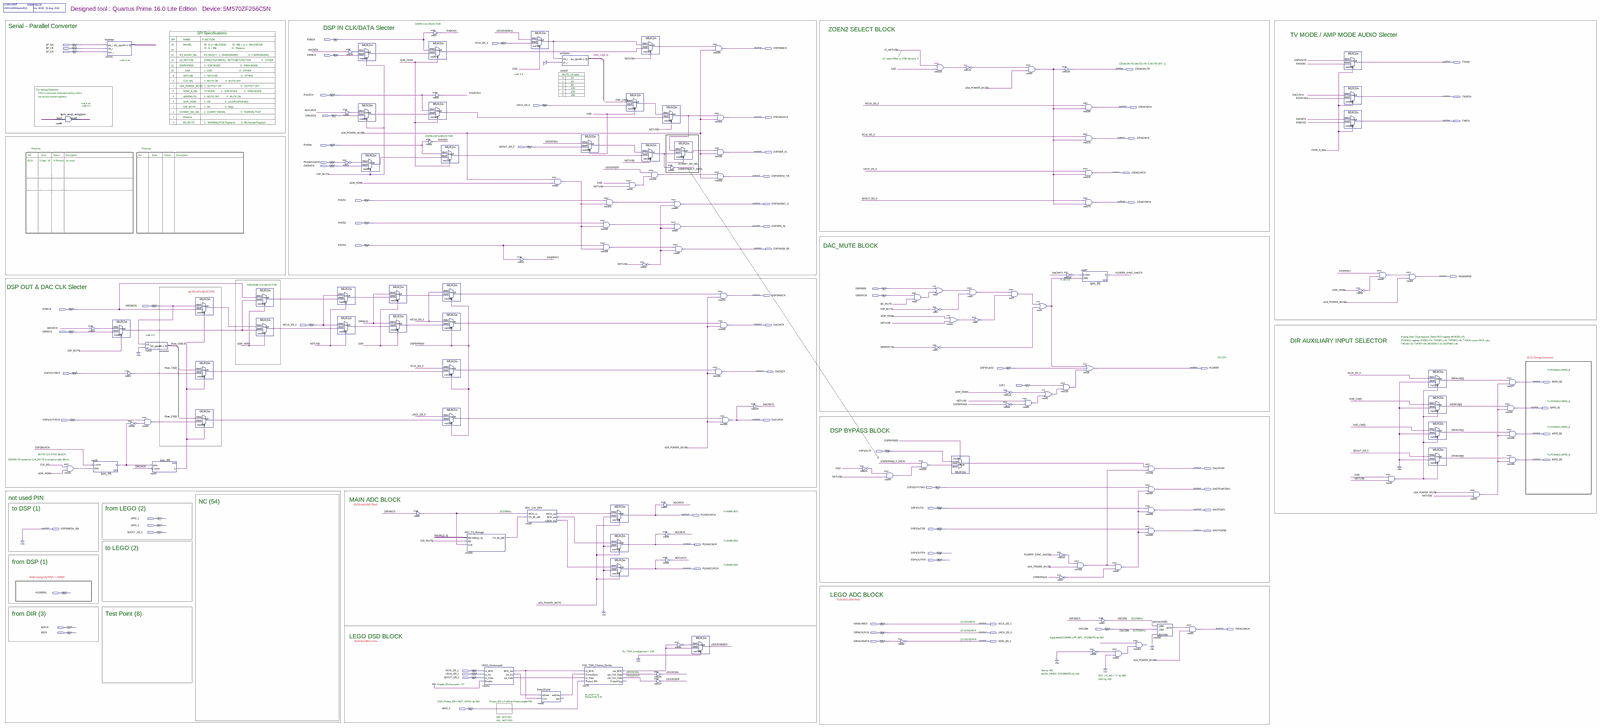
[diagram p0: schematic sheet, whole]
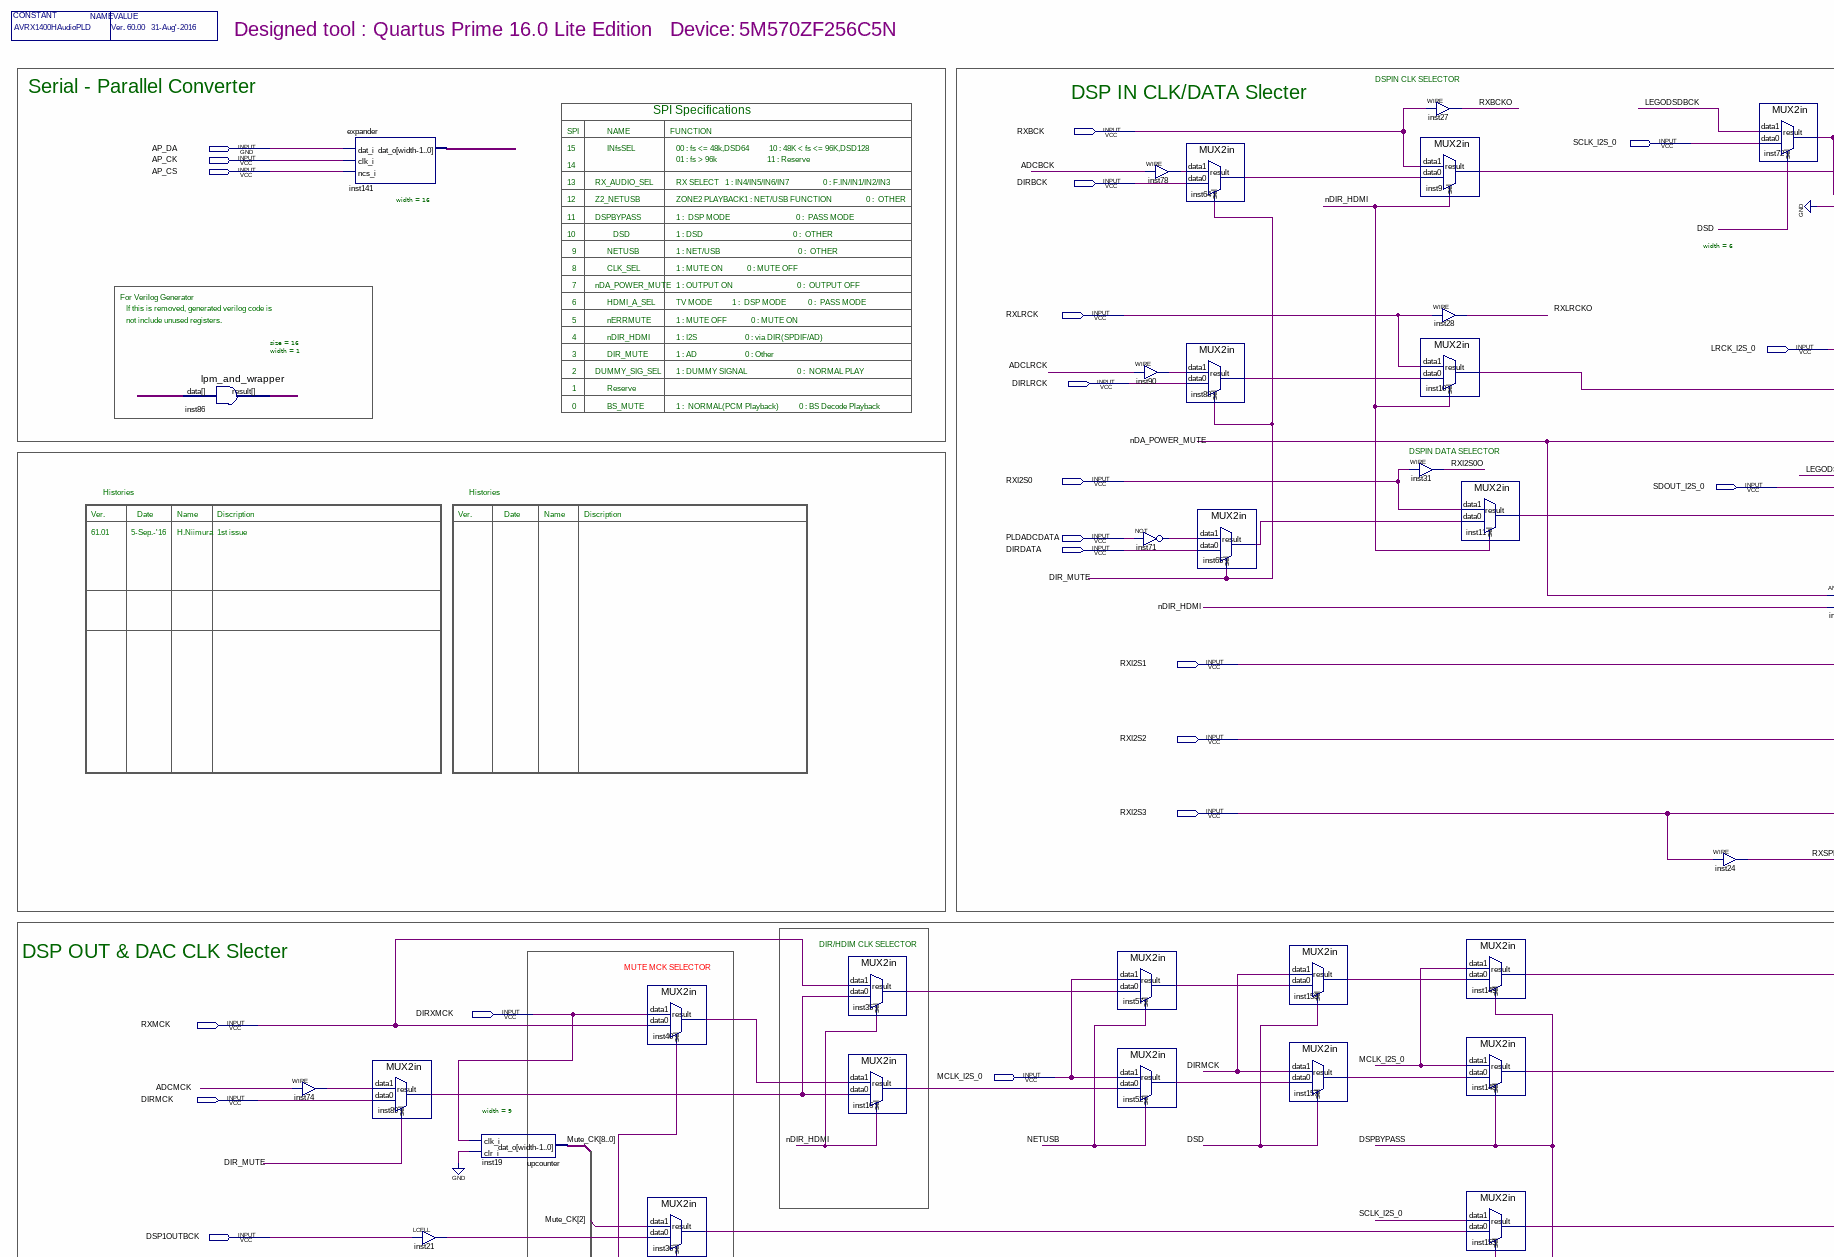
[diagram p1: schematic sheet, upper left part]
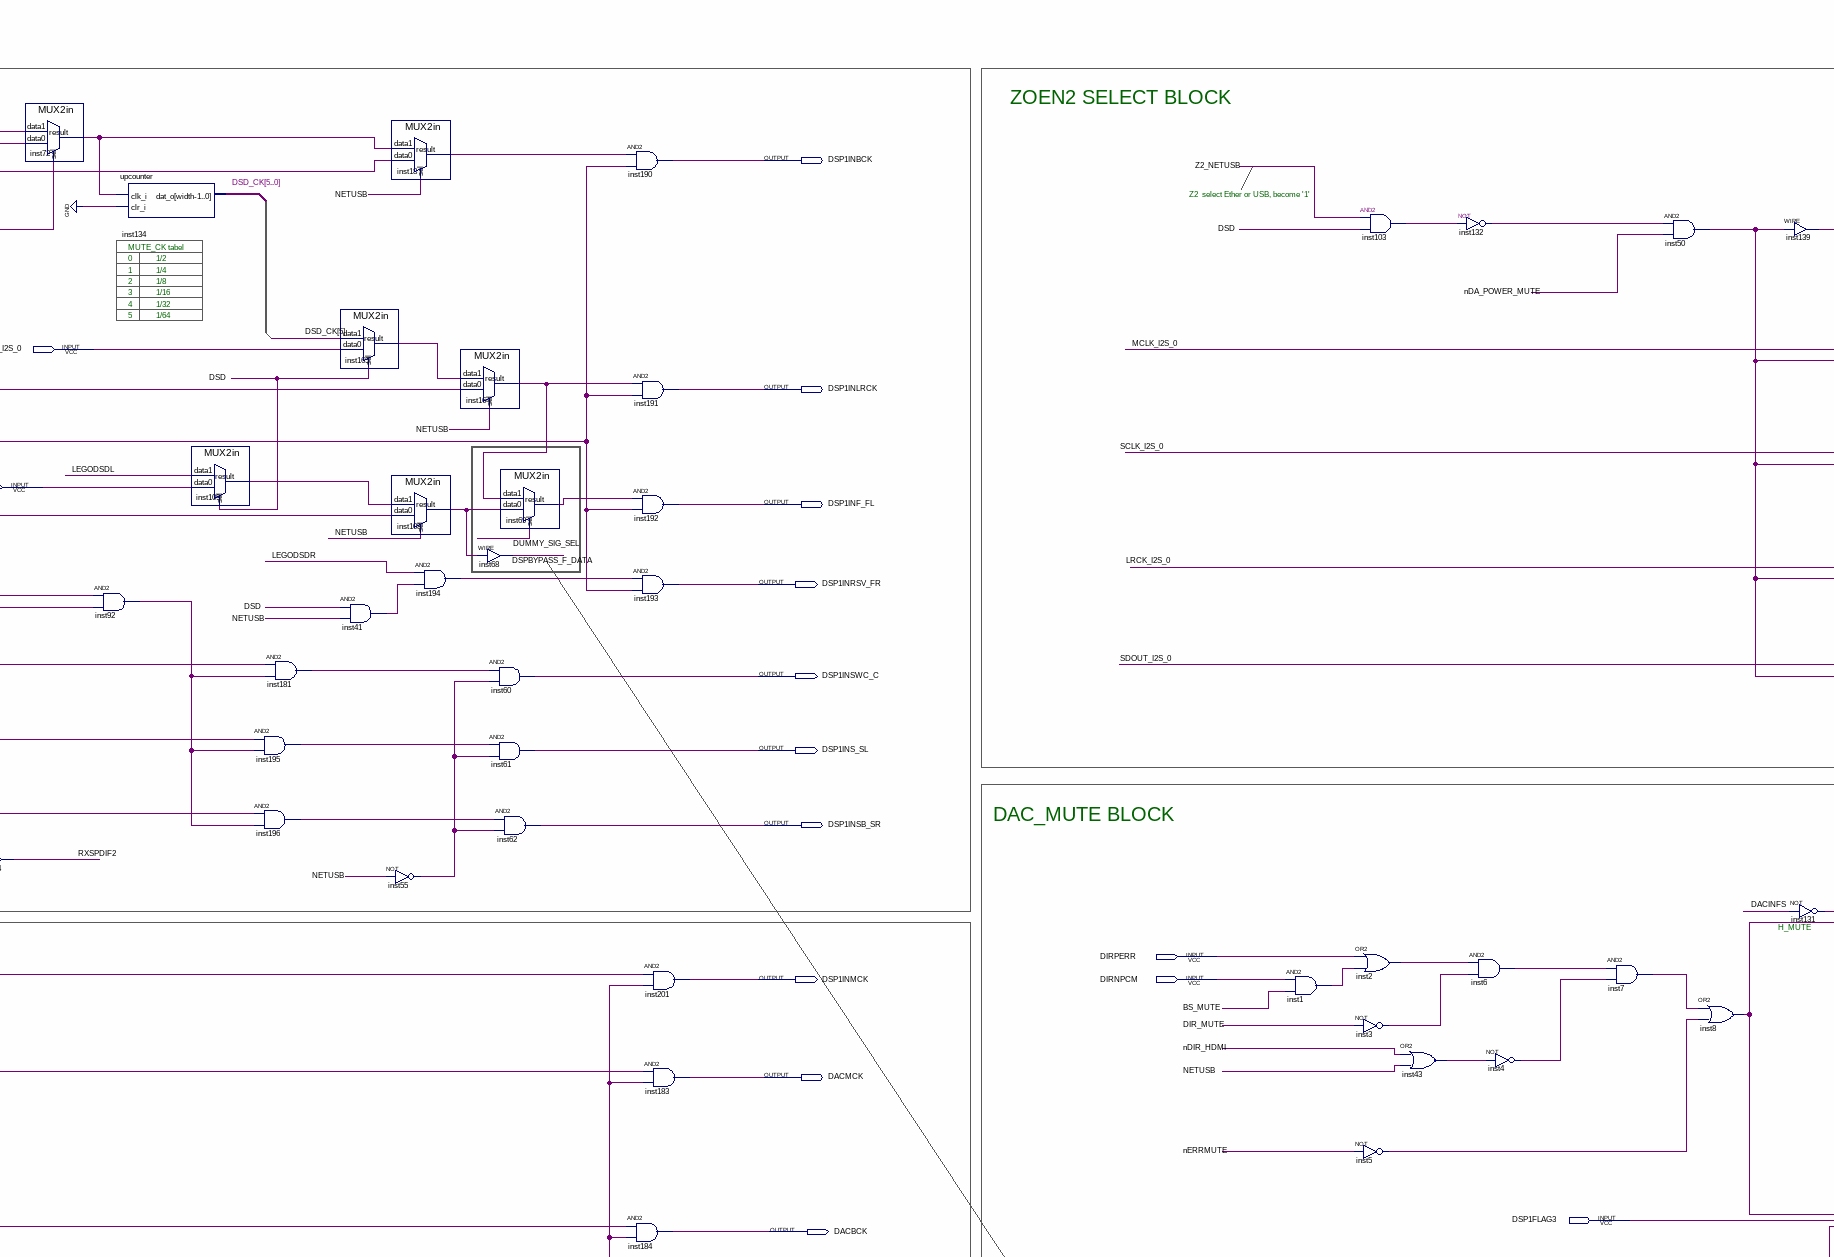
[diagram p2: schematic sheet, upper centre part]
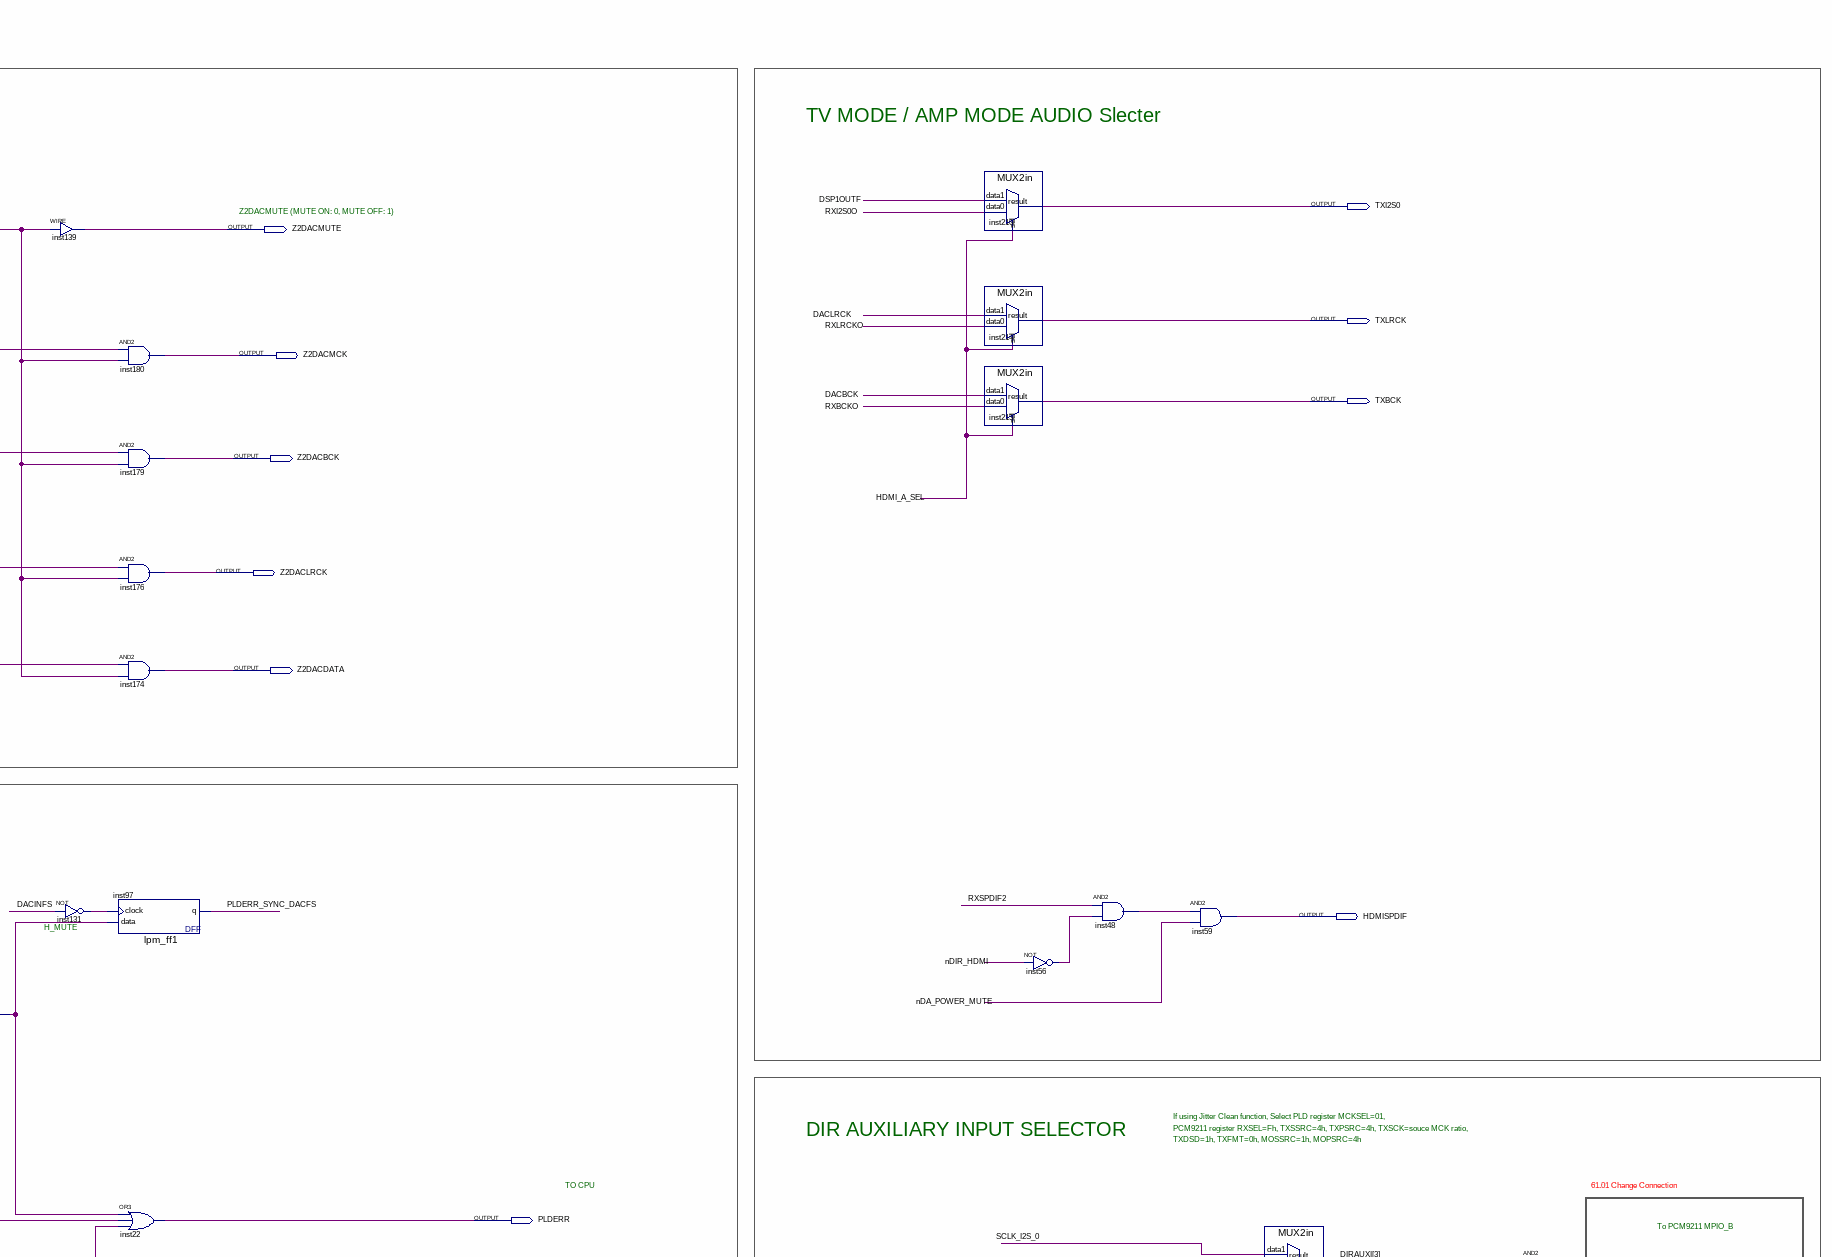
[diagram p3: schematic sheet, upper right part]
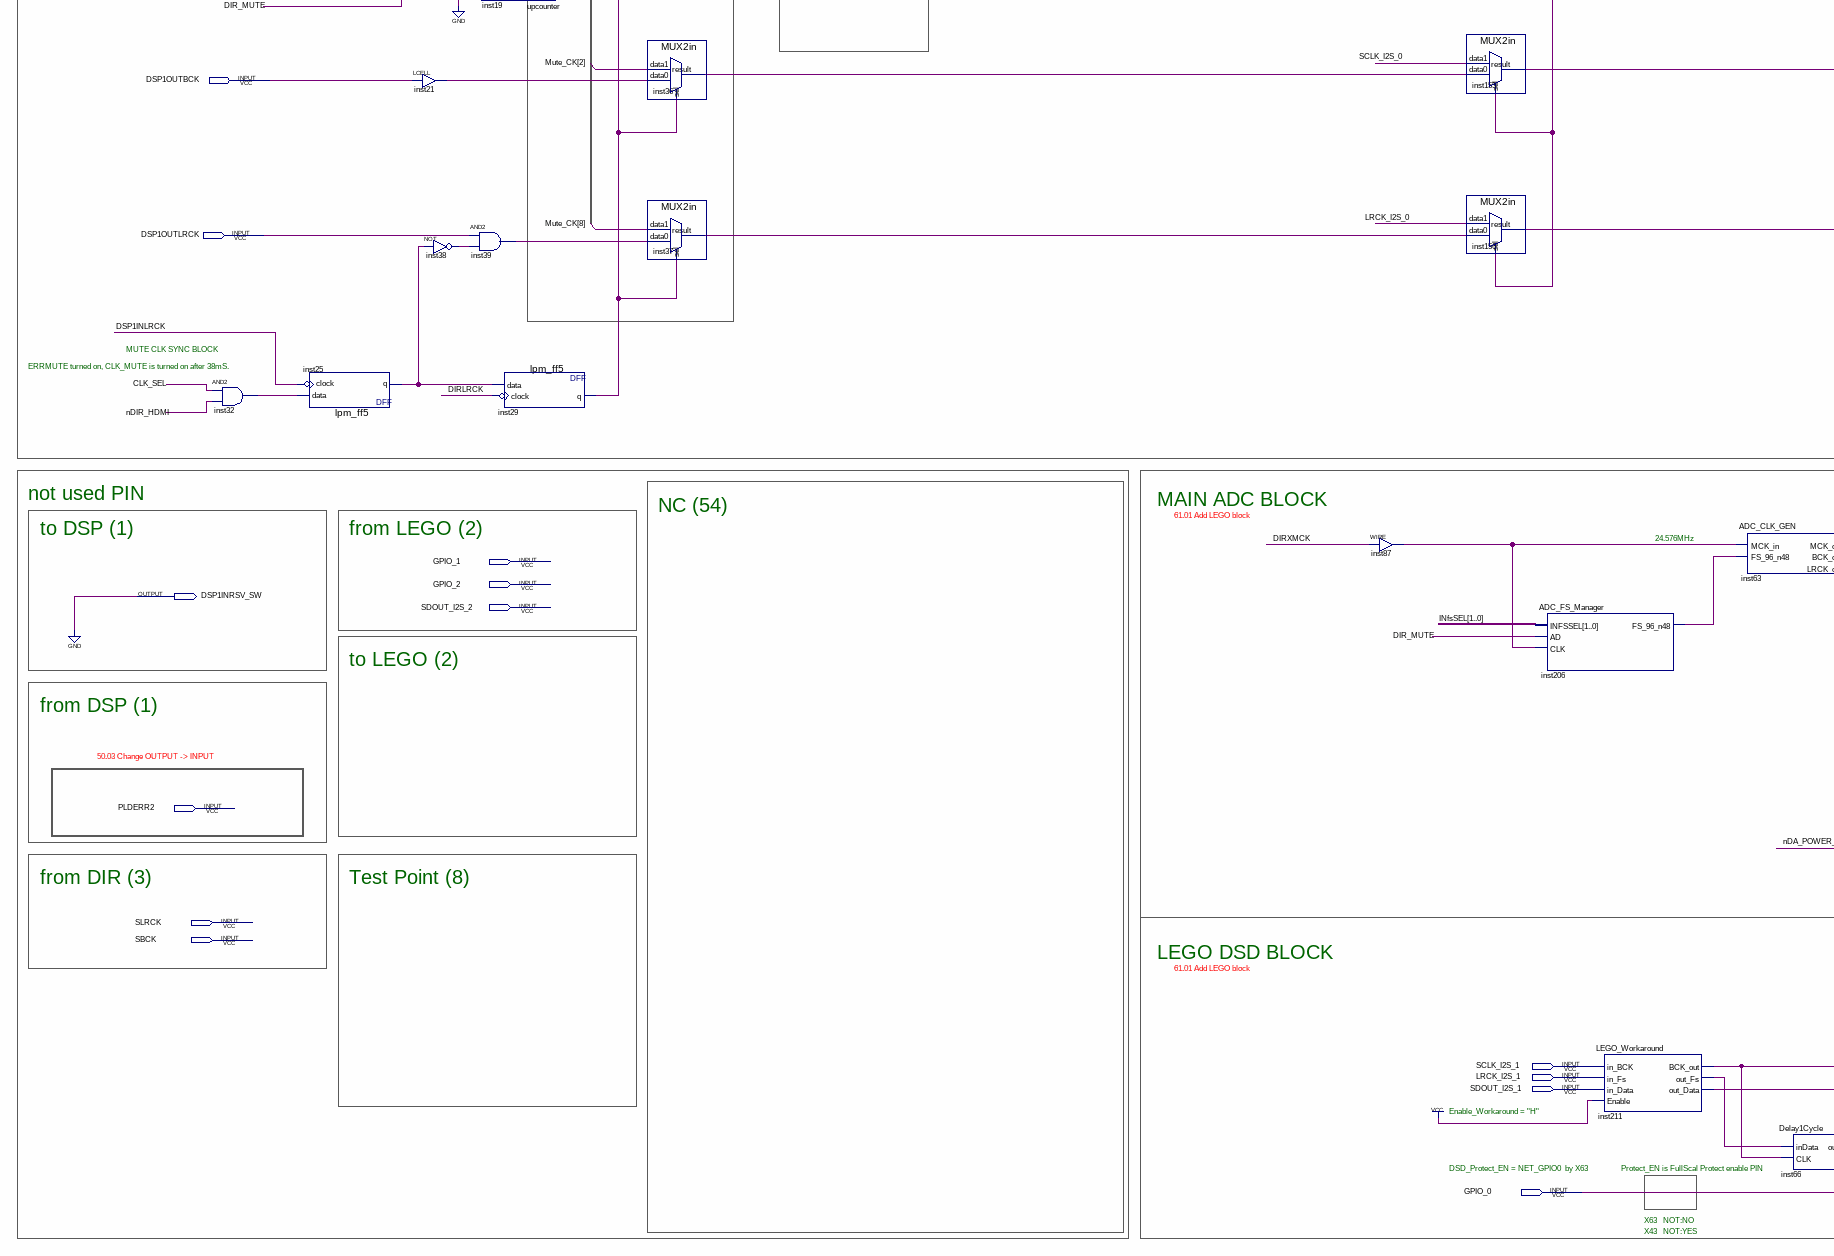
[diagram p4: schematic sheet, lower left part]
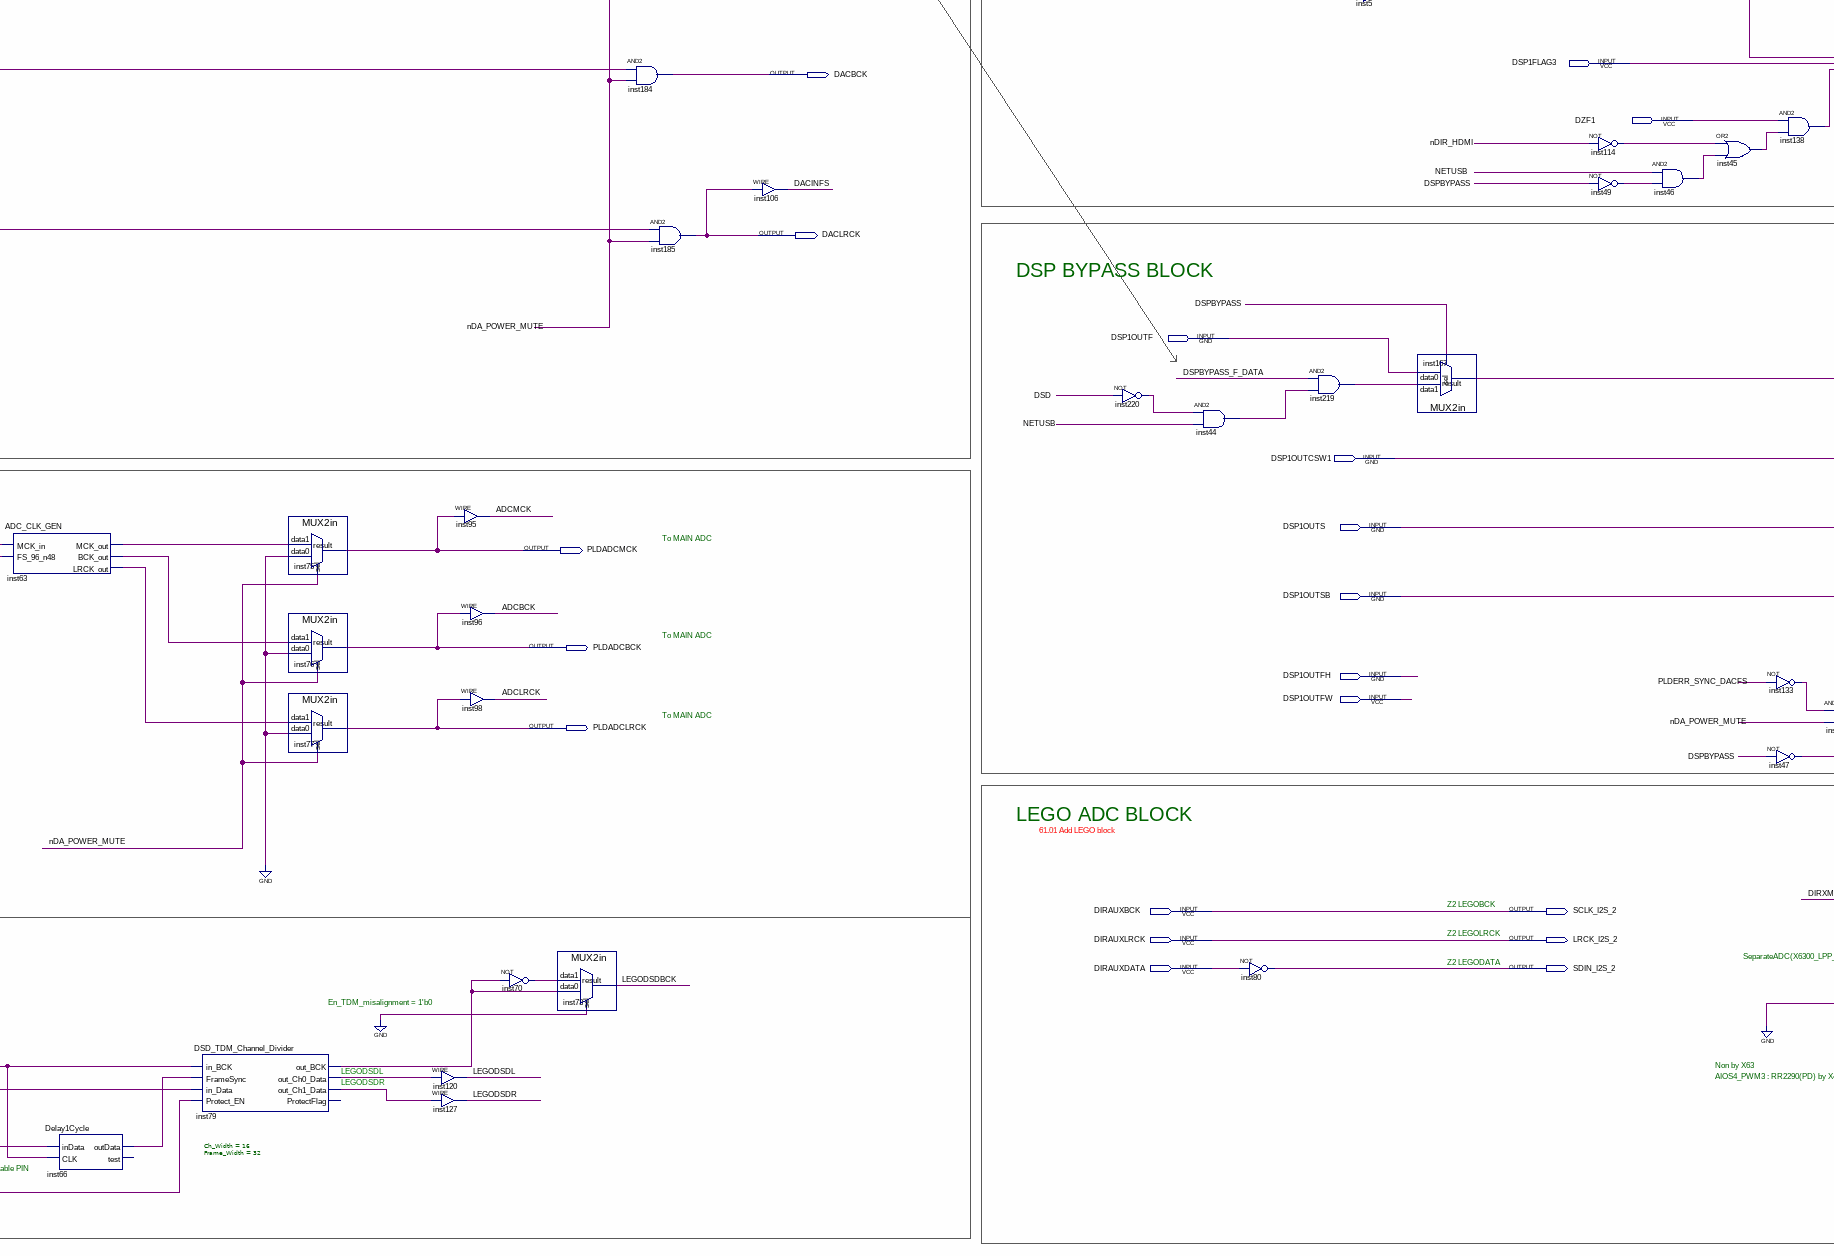
[diagram p5: schematic sheet, lower centre part]
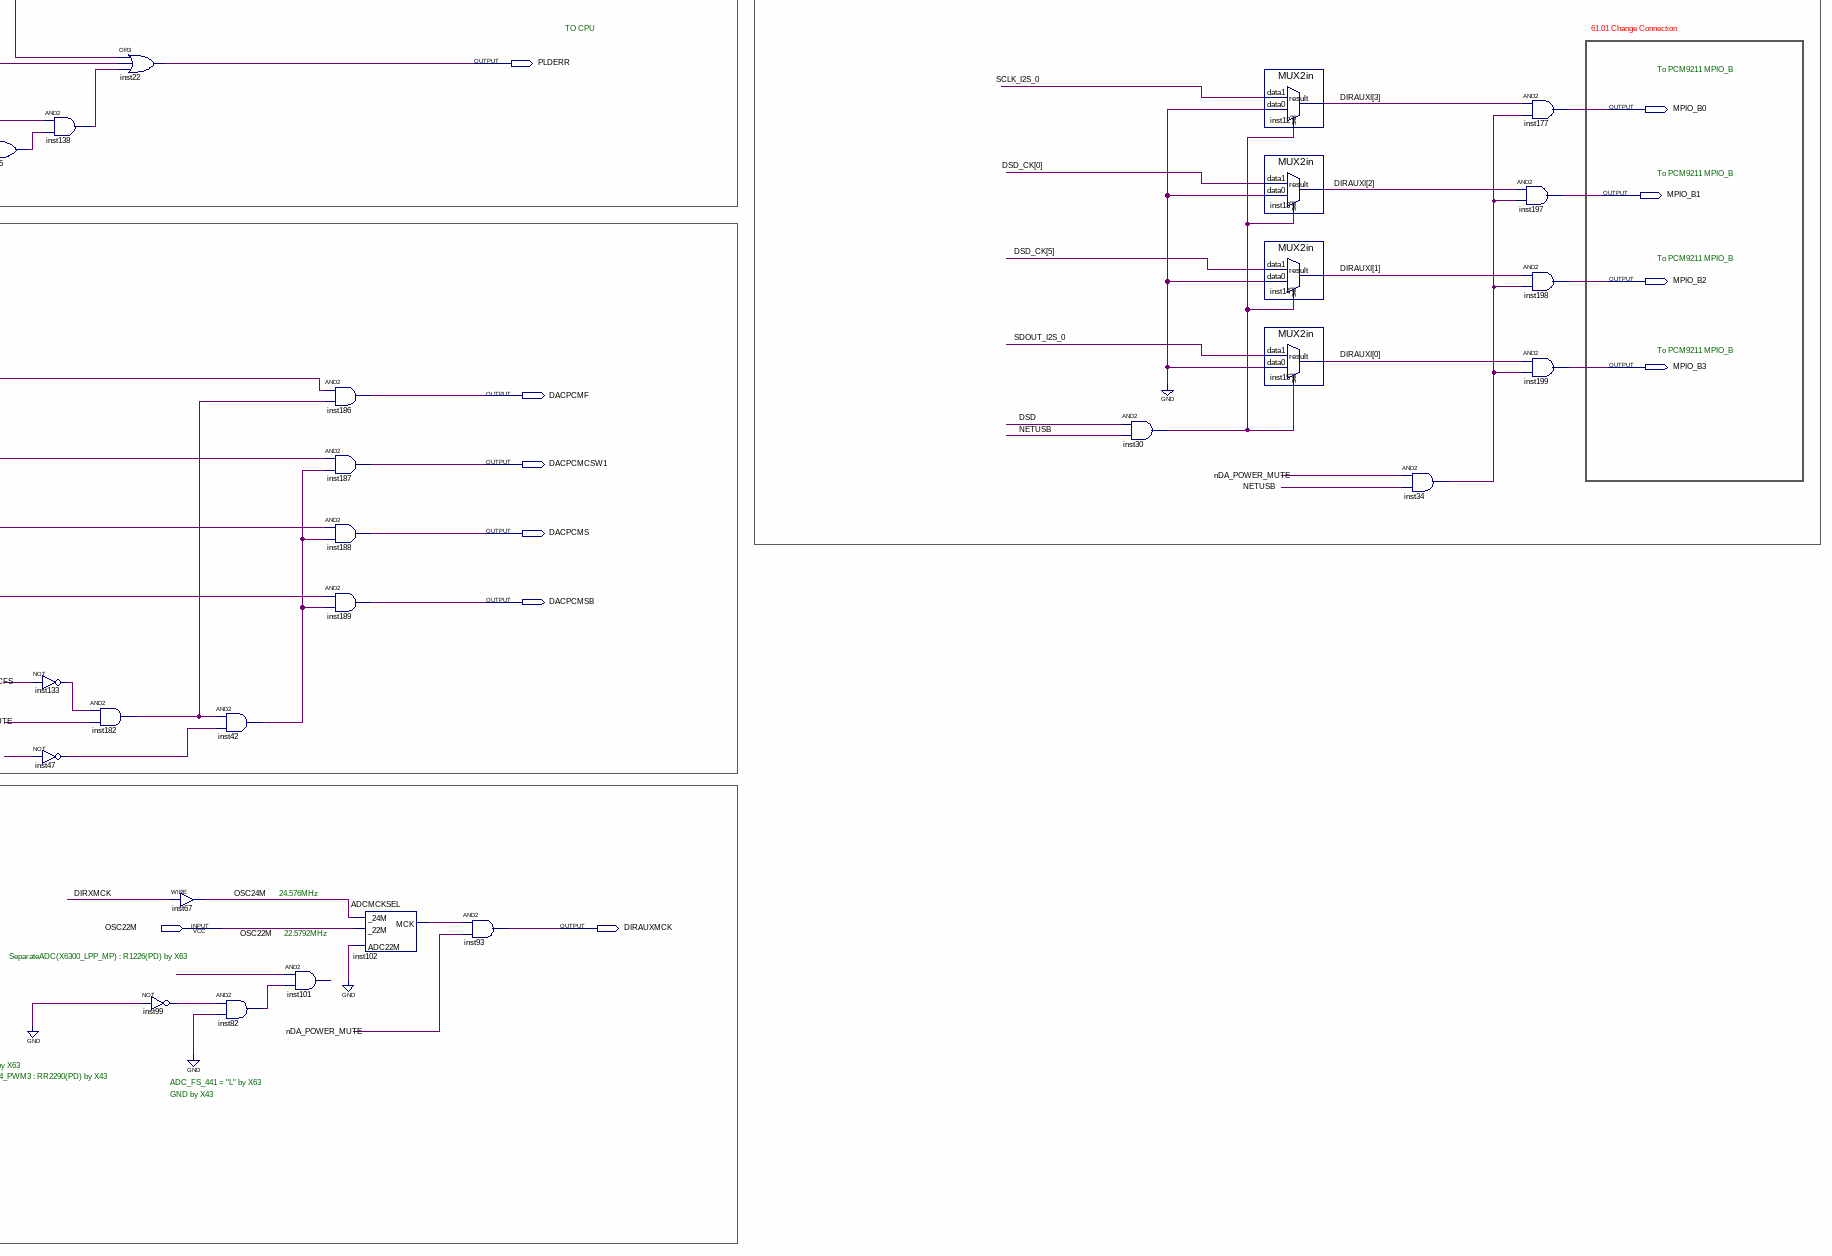
[diagram p6: schematic sheet, lower right part]
// Quartus schematic AVRX1400H.bdf as structural Verilog: 141 symbols, 83 pins
module AVRX1400H #(parameter AVRX1400HAudioPLD = "Ver. 60.00   31-Aug'-2016") (
  input  RXBCK,
  input  SCLK_I2S_0,
  input  AP_DA,
  input  AP_CK,
  input  AP_CS,
  input  DIRBCK,
  input  RXLRCK,
  input  LRCK_I2S_0,
  input  DIRLRCK,
  input  RXI2S0,
  input  SDOUT_I2S_0,
  input  PLDADCDATA,
  input  DIRDATA,
  input  RXI2S1,
  input  RXI2S2,
  input  RXI2S3,
  input  DIRPERR,
  input  DIRNPCM,
  input  DIRXMCK,
  input  RXMCK,
  input  MCLK_I2S_0,
  input  DIRMCK,
  input  DSP1FLAG3,
  input  DSP1OUTBCK,
  input  DZF1,
  input  DSP1OUTLRCK,
  input  DSP1OUTF,
  input  DSP1OUTCSW1,
  input  DSP1OUTS,
  input  GPIO_1,
  input  GPIO_2,
  input  DSP1OUTSB,
  input  SDOUT_I2S_2,
  input  DSP1OUTFH,
  input  DSP1OUTFW,
  input  PLDERR2,
  input  DIRAUXBCK,
  input  SLRCK,
  input  OSC22M,
  input  SBCK,
  input  DIRAUXLRCK,
  input  DIRAUXDATA,
  input  SCLK_I2S_1,
  input  LRCK_I2S_1,
  input  SDOUT_I2S_1,
  input  GPIO_0,
  output DSP1INBCK,
  output TXI2S0,
  output Z2DACMUTE,
  output TXLRCK,
  output Z2DACMCK,
  output DSP1INLRCK,
  output TXBCK,
  output Z2DACBCK,
  output DSP1INF_FL,
  output Z2DACLRCK,
  output DSP1INRSV_FR,
  output Z2DACDATA,
  output DSP1INSWC_C,
  output DSP1INS_SL,
  output DSP1INSB_SR,
  output HDMISPDIF,
  output DSP1INMCK,
  output DACMCK,
  output PLDERR,
  output DACBCK,
  output MPIO_B0,
  output MPIO_B1,
  output DACLRCK,
  output MPIO_B2,
  output MPIO_B3,
  output DACPCMF,
  output DACPCMCSW1,
  output DACPCMS,
  output PLDADCMCK,
  output DSP1INRSV_SW,
  output DACPCMSB,
  output PLDADCBCK,
  output PLDADCLRCK,
  output SCLK_I2S_2,
  output DIRAUXMCK,
  output LRCK_I2S_2,
  output SDIN_I2S_2
);

  wire \/DA_POWER_MUTE , \/DIR_HDMI , \/ERRMUTE , ADCBCK, ADCLRCK, ADCMCK, BS_MUTE, CLK_SEL, DACINFS,
       DIR_MUTE, DSD, DSPBYPASS, DSPBYPASS_F_DATA, DUMMY_SIG_SEL, HDMI_A_SEL, inst1_out, inst2_out,
       inst3_out, inst4_out, inst5_out, inst6_out, inst7_out, inst8_out, inst9_result, inst10_result,
       inst11_result, inst16_result, inst18_result, inst21_out, inst25_q, inst29_q, inst30_out, inst32_out,
       inst34_out, inst35_result, inst36_result, inst37_result, inst38_out, inst39_out, inst40_result,
       inst41_out, inst42_out, inst43_out, inst44_out, inst45_out, inst46_out, inst47_out, inst48_out,
       inst49_out, inst50_out, inst52_result, inst55_out, inst56_out, inst57_result, inst63_bck_out,
       inst63_lrck_out, inst63_mck_out, inst64_result, inst65_result, inst66_outdata, inst69_result,
       inst70_out, inst71_out, inst72_result, inst74_out, inst78_out, inst79_out_bck, inst79_out_ch0_data,
       inst79_out_ch1_data, inst82_out, inst86_result, inst87_out, inst88_result, inst89_result, inst90_out,
       inst92_out, inst99_out, inst102_mck, inst103_out, inst108_result, inst109_result, inst114_out,
       inst131_out, inst132_out, inst133_out, inst138_out, inst148_result, inst149_result, inst155_result,
       inst156_result, inst157_result, inst158_result, inst164_result, inst165_result, inst167_result,
       inst181_out, inst182_out, inst194_out, inst195_out, inst196_out, inst206_fs_96_n48, inst211_bck_out,
       inst211_out_data, inst211_out_fs, inst219_out, inst220_out, LEGODSDBCK, LEGODSDL, LEGODSDR,
       nDA_POWER_MUTE, nDIR_HDMI, nERRMUTE, \NET/USB , NETUSB, OSC24M, PLDERR_SYNC_DACFS, Reserve,
       RX_AUDIO_SEL, RXBCKO, RXI2S0O, RXLRCKO, RXSPDIF2, undriven, \Z2_NET/USB , Z2_NETUSB;
  wire [1:0] INfsSEL;
  wire [3:0] DIRAUXI;
  wire [5:0] DSD_CK;
  wire [8:0] Mute_CK;

  lpm_and_wrapper #(.size(16), .width(1)) inst86 (
    .data({INfsSEL, RX_AUDIO_SEL, \Z2_NET/USB , DSPBYPASS, DSD, \NET/USB , CLK_SEL, \/DA_POWER_MUTE , HDMI_A_SEL, \/ERRMUTE , \/DIR_HDMI , DIR_MUTE, DUMMY_SIG_SEL, Reserve, BS_MUTE}),
    .result(inst86_result));
  and inst32 (inst32_out, CLK_SEL, nDIR_HDMI);
  assign inst74_out = ADCMCK;  // WIRE inst74
  lpm_ff5 inst25 (.data(inst32_out), .clock(~DSP1INLRCK), .q(inst25_q));
  expander #(.width(16)) inst141 (
    .dat_i(AP_DA), .clk_i(AP_CK), .ncs_i(AP_CS),
    .dat_o({INfsSEL, RX_AUDIO_SEL, Z2_NETUSB, DSPBYPASS, DSD, NETUSB, CLK_SEL, nDA_POWER_MUTE, HDMI_A_SEL, nERRMUTE, nDIR_HDMI, DIR_MUTE, DUMMY_SIG_SEL, Reserve, BS_MUTE}));
  MUX2in inst89 (.data1(inst74_out), .data0(DIRMCK), .sel(DIR_MUTE), .result(inst89_result));
  LCELL inst21 (.IN(DSP1OUTBCK), .OUT(inst21_out));
  not inst38 (inst38_out, inst25_q);
  upcounter #(.width(9)) inst19 (.clk_i(DIRXMCK), .clr_i(1'b0), .dat_o(Mute_CK));
  and inst39 (inst39_out, DSP1OUTLRCK, inst38_out);
  lpm_ff5 inst29 (.data(inst25_q), .clock(~DIRLRCK), .q(inst29_q));
  MUX2in inst40 (.data1(DIRXMCK), .data0(RXMCK), .sel(inst29_q), .result(inst40_result));
  MUX2in inst36 (.data1(Mute_CK[2]), .data0(inst21_out), .sel(inst29_q), .result(inst36_result));
  MUX2in inst37 (.data1(Mute_CK[8]), .data0(inst39_out), .sel(inst29_q), .result(inst37_result));
  MUX2in inst35 (.data1(RXMCK), .data0(inst89_result), .sel(nDIR_HDMI), .result(inst35_result));
  MUX2in inst16 (.data1(inst40_result), .data0(inst89_result), .sel(nDIR_HDMI), .result(inst16_result));
  assign inst90_out = ADCLRCK;  // WIRE inst90
  not inst71 (inst71_out, PLDADCDATA);
  MUX2in inst57 (.data1(MCLK_I2S_0), .data0(inst35_result), .sel(NETUSB), .result(inst57_result));
  MUX2in inst52 (.data1(MCLK_I2S_0), .data0(inst16_result), .sel(NETUSB), .result(inst52_result));
  assign inst78_out = ADCBCK;  // WIRE inst78
  MUX2in inst64 (.data1(inst78_out), .data0(DIRBCK), .sel(DIR_MUTE), .result(inst64_result));
  MUX2in inst88 (.data1(inst90_out), .data0(DIRLRCK), .sel(DIR_MUTE), .result(inst88_result));
  MUX2in inst65 (.data1(inst71_out), .data0(DIRDATA), .sel(DIR_MUTE), .result(inst65_result));
  MUX2in inst158 (.data1(DIRMCK), .data0(inst57_result), .sel(DSD), .result(inst158_result));
  MUX2in inst157 (.data1(DIRMCK), .data0(inst52_result), .sel(DSD), .result(inst157_result));
  assign RXI2S0O = RXI2S0;  // WIRE inst31
  assign inst87_out = DIRXMCK;  // WIRE inst87
  assign RXBCKO = RXBCK;  // WIRE inst27
  MUX2in inst9 (.data1(RXBCK), .data0(inst64_result), .sel(nDIR_HDMI), .result(inst9_result));
  assign RXLRCKO = RXLRCK;  // WIRE inst28
  MUX2in inst10 (.data1(RXLRCK), .data0(inst88_result), .sel(nDIR_HDMI), .result(inst10_result));
  MUX2in inst11 (.data1(RXI2S0), .data0(inst65_result), .sel(nDIR_HDMI), .result(inst11_result));
  MUX2in inst149 (.data1(MCLK_I2S_0), .data0(inst158_result), .sel(DSPBYPASS), .result(inst149_result));
  MUX2in inst148 (.data1(MCLK_I2S_0), .data0(inst157_result), .sel(DSPBYPASS), .result(inst148_result));
  MUX2in inst155 (.data1(SCLK_I2S_0), .data0(inst36_result), .sel(DSPBYPASS), .result(inst155_result));
  MUX2in inst156 (.data1(LRCK_I2S_0), .data0(inst37_result), .sel(DSPBYPASS), .result(inst156_result));
  ADC_FS_Manager inst206 (.INFSSEL(INfsSEL), .AD(DIR_MUTE), .CLK(inst87_out), .FS_96_n48(inst206_fs_96_n48));
  LEGO_Workaround inst211 (
    .in_BCK(SCLK_I2S_1), .in_Fs(LRCK_I2S_1), .in_Data(SDOUT_I2S_1), .Enable(1'b1), .BCK_out(inst211_bck_out),
    .out_Fs(inst211_out_fs), .out_Data(inst211_out_data));
  assign RXSPDIF2 = RXI2S3;  // WIRE inst24
  MUX2in inst72 (.data1(LEGODSDBCK), .data0(SCLK_I2S_0), .sel(DSD), .result(inst72_result));
  ADC_CLK_GEN inst63 (
    .MCK_in(inst87_out), .FS_96_n48(inst206_fs_96_n48), .MCK_out(inst63_mck_out), .BCK_out(inst63_bck_out),
    .LRCK_out(inst63_lrck_out));
  Delay1Cycle inst66 (.inData(inst211_out_fs), .CLK(inst211_bck_out), .outData(inst66_outdata));  // open: test
  upcounter #(.width(6)) inst134 (.clk_i(inst72_result), .clr_i(1'b0), .dat_o(DSD_CK));
  and inst92 (inst92_out, nDA_POWER_MUTE, nDIR_HDMI);
  MUX2in inst109 (.data1(LEGODSDL), .data0(SDOUT_I2S_0), .sel(DSD), .result(inst109_result));
  DSD_TDM_Channel_Divider #(.Ch_Width(16), .Frame_Width(32)) inst79 (
    .in_BCK(inst211_bck_out), .FrameSync(inst66_outdata), .in_Data(inst211_out_data), .Protect_EN(GPIO_0),
    .out_BCK(inst79_out_bck), .out_Ch0_Data(inst79_out_ch0_data), .out_Ch1_Data(inst79_out_ch1_data));  // open: ProtectFlag
  and inst181 (inst181_out, RXI2S1, inst92_out);
  and inst195 (inst195_out, RXI2S2, inst92_out);
  and inst196 (inst196_out, RXI2S3, inst92_out);
  MUX2in inst75 (.data1(inst63_mck_out), .data0(1'b0), .sel(nDA_POWER_MUTE), .result(PLDADCMCK));
  MUX2in inst76 (.data1(inst63_bck_out), .data0(1'b0), .sel(nDA_POWER_MUTE), .result(PLDADCBCK));
  MUX2in inst77 (.data1(inst63_lrck_out), .data0(1'b0), .sel(nDA_POWER_MUTE), .result(PLDADCLRCK));
  MUX2in inst165 (.data1(DSD_CK[5]), .data0(LRCK_I2S_0), .sel(DSD), .result(inst165_result));
  and inst41 (inst41_out, DSD, NETUSB);
  MUX2in inst18 (.data1(inst72_result), .data0(inst9_result), .sel(NETUSB), .result(inst18_result));
  MUX2in inst108 (.data1(inst109_result), .data0(inst11_result), .sel(NETUSB), .result(inst108_result));
  not inst55 (inst55_out, NETUSB);
  and inst194 (inst194_out, LEGODSDR, inst41_out);
  assign ADCMCK = PLDADCMCK;  // WIRE inst95
  assign LEGODSDL = inst79_out_ch0_data;  // WIRE inst120
  assign LEGODSDR = inst79_out_ch1_data;  // WIRE inst127
  MUX2in inst164 (.data1(inst165_result), .data0(inst10_result), .sel(NETUSB), .result(inst164_result));
  MUX2in inst69 (.data1(inst164_result), .data0(inst108_result), .sel(DUMMY_SIG_SEL), .result(inst69_result));
  assign DSPBYPASS_F_DATA = inst108_result;  // WIRE inst68
  and inst60 (DSP1INSWC_C, inst181_out, inst55_out);
  and inst61 (DSP1INS_SL, inst195_out, inst55_out);
  and inst62 (DSP1INSB_SR, inst196_out, inst55_out);
  assign ADCBCK = PLDADCBCK;  // WIRE inst96
  assign ADCLRCK = PLDADCLRCK;  // WIRE inst98
  not inst70 (inst70_out, inst79_out_bck);
  MUX2in inst73 (.data1(inst70_out), .data0(inst79_out_bck), .sel(1'b0), .result(LEGODSDBCK));
  and inst190 (DSP1INBCK, inst18_result, nDA_POWER_MUTE);
  and inst191 (DSP1INLRCK, inst164_result, nDA_POWER_MUTE);
  and inst192 (DSP1INF_FL, inst69_result, nDA_POWER_MUTE);
  and inst193 (DSP1INRSV_FR, inst194_out, nDA_POWER_MUTE);
  and inst184 (DACBCK, inst155_result, nDA_POWER_MUTE);
  and inst201 (DSP1INMCK, inst149_result, nDA_POWER_MUTE);
  and inst183 (DACMCK, inst148_result, nDA_POWER_MUTE);
  and inst185 (DACLRCK, inst156_result, nDA_POWER_MUTE);
  assign DACINFS = DACLRCK;  // WIRE inst106
  not inst220 (inst220_out, DSD);
  and inst44 (inst44_out, inst220_out, NETUSB);
  not inst80 (SDIN_I2S_2, DIRAUXDATA);
  and inst1 (inst1_out, DIRNPCM, BS_MUTE);
  and inst219 (inst219_out, DSPBYPASS_F_DATA, inst44_out);
  and inst103 (inst103_out, Z2_NETUSB, DSD);
  or inst2 (inst2_out, DIRPERR, inst1_out);
  not inst3 (inst3_out, DIR_MUTE);
  not inst5 (inst5_out, nERRMUTE);
  or inst43 (inst43_out, nDIR_HDMI, NETUSB);
  MUX2in inst167 (.data1(inst219_out), .data0(DSP1OUTF), .sel(DSPBYPASS), .result(inst167_result));
  not inst132 (inst132_out, inst103_out);
  and inst6 (inst6_out, inst2_out, inst3_out);
  not inst4 (inst4_out, inst43_out);
  not inst114 (inst114_out, nDIR_HDMI);
  not inst49 (inst49_out, DSPBYPASS);
  and inst7 (inst7_out, inst6_out, inst4_out);
  and inst50 (inst50_out, inst132_out, nDA_POWER_MUTE);
  and inst46 (inst46_out, NETUSB, inst49_out);
  or inst8 (inst8_out, inst7_out, inst5_out);
  or inst45 (inst45_out, inst114_out, inst46_out);
  assign Z2DACMUTE = inst50_out;  // WIRE inst139
  and inst138 (inst138_out, DZF1, inst45_out);
  not inst133 (inst133_out, PLDERR_SYNC_DACFS);
  not inst47 (inst47_out, DSPBYPASS);
  not inst131 (inst131_out, DACINFS);
  and inst182 (inst182_out, inst133_out, nDA_POWER_MUTE);
  and inst180 (Z2DACMCK, MCLK_I2S_0, inst50_out);
  and inst179 (Z2DACBCK, SCLK_I2S_0, inst50_out);
  and inst176 (Z2DACLRCK, LRCK_I2S_0, inst50_out);
  and inst174 (Z2DACDATA, SDOUT_I2S_0, inst50_out);
  lpm_ff1 inst97 (.data(inst8_out), .clock(inst131_out), .q(PLDERR_SYNC_DACFS));
  or inst22 (PLDERR, inst8_out, DSP1FLAG3, inst138_out);
  not inst99 (inst99_out, 1'b0);
  assign OSC24M = DIRXMCK;  // WIRE inst67
  and inst42 (inst42_out, inst182_out, inst47_out);
  and inst82 (inst82_out, inst99_out, 1'b0);
  and inst186 (DACPCMF, inst167_result, inst182_out);
  and inst187 (DACPCMCSW1, DSP1OUTCSW1, inst42_out);
  and inst188 (DACPCMS, DSP1OUTS, inst42_out);
  and inst189 (DACPCMSB, DSP1OUTSB, inst42_out);
  // AND2 inst101 has open pins: IN1=undriven, IN2=inst82_out, OUT=open
  ADCMCKSEL inst102 (._24M(OSC24M), ._22M(OSC22M), .ADC22M(1'b0), .MCK(inst102_mck));
  and inst93 (DIRAUXMCK, inst102_mck, nDA_POWER_MUTE);
  MUX2in inst210 (.data1(DSP1OUTF), .data0(RXI2S0O), .sel(HDMI_A_SEL), .result(TXI2S0));
  MUX2in inst214 (.data1(DACLRCK), .data0(RXLRCKO), .sel(HDMI_A_SEL), .result(TXLRCK));
  MUX2in inst215 (.data1(DACBCK), .data0(RXBCKO), .sel(HDMI_A_SEL), .result(TXBCK));
  not inst56 (inst56_out, nDIR_HDMI);
  and inst48 (inst48_out, RXSPDIF2, inst56_out);
  and inst30 (inst30_out, DSD, NETUSB);
  and inst59 (HDMISPDIF, inst48_out, nDA_POWER_MUTE);
  MUX2in inst12 (.data1(SCLK_I2S_0), .data0(1'b0), .sel(inst30_out), .result(DIRAUXI[3]));
  MUX2in inst13 (.data1(DSD_CK[0]), .data0(1'b0), .sel(inst30_out), .result(DIRAUXI[2]));
  MUX2in inst14 (.data1(DSD_CK[5]), .data0(1'b0), .sel(inst30_out), .result(DIRAUXI[1]));
  MUX2in inst15 (.data1(SDOUT_I2S_0), .data0(1'b0), .sel(inst30_out), .result(DIRAUXI[0]));
  and inst34 (inst34_out, nDA_POWER_MUTE, NETUSB);
  and inst197 (MPIO_B1, DIRAUXI[2], inst34_out);
  and inst177 (MPIO_B0, DIRAUXI[3], inst34_out);
  and inst198 (MPIO_B2, DIRAUXI[1], inst34_out);
  and inst199 (MPIO_B3, DIRAUXI[0], inst34_out);

  assign DSP1INRSV_SW = 1'b0;
  assign LRCK_I2S_2 = DIRAUXLRCK;
  assign SCLK_I2S_2 = DIRAUXBCK;

  // Notes on the sheet:
  //   Designed tool : Quartus Prime 16.0 Lite Edition
  //   Device:
  //   5M570ZF256C5N
  //   Serial - Parallel Converter
  //   DSPIN CLK SELECTOR
  //   DSP IN CLK/DATA Slecter
  //   ZOEN2 SELECT BLOCK
  //   SPI Specifications
  //   TV MODE / AMP MODE AUDIO Slecter
  //   SPI
  //   NAME
  //   FUNCTION
  //   15
  //   INfsSEL
  //   00 : fs <= 48k,DSD64          10 : 48K < fs <= 96K,DSD128
  //   01 : fs > 96k                         11 : Reserve
  //   14
  //   13
  //   RX_AUDIO_SEL
  //   RX SELECT   1 : IN4/IN5/IN6/IN7                 0 : F.IN/IN1/IN2/IN3
  //   Z2  select Ether or USB, become '1'
  //   12
  //   Z2_NETUSB
  //   ZONE2 PLAYBACK1 : NET/USB FUNCTION                 0 :  OTHER
  //   Z2DACMUTE (MUTE ON: 0, MUTE OFF: 1)
  //   11
  //   DSPBYPASS
  //   1 :  DSP MODE                                 0 :  PASS MODE
  //   10
  //   DSD
  //   1 : DSD                                             0 :  OTHER
  //   MUTE_CK tabel
  //   9
  //   NETUSB
  //   1 : NET/USB                                       0 :  OTHER
  //   0
  //   1/2
  //   8
  //   CLK_SEL
  //   1 : MUTE ON            0 : MUTE OFF
  //   1
  //   1/4
  //   2
  //   1/8
  //   7
  //   nDA_POWER_MUTE
  //   1 : OUTPUT ON                                0 :  OUTPUT OFF
  //   3
  //   1/16
  //   For Verilog Generator
  //   6
  //   HDMI_A_SEL
  //   TV MODE          1 :  DSP MODE           0 :  PASS MODE
  //   4
  //   1/32
  //   If this is removed, generated verilog code is 
  //   5
  //   1/64
  //   not include unused registers. 
  //   5
  //   nERRMUTE
  //   1 : MUTE OFF            0 : MUTE ON
  //   4
  //   nDIR_HDMI
  //   1 : I2S                        0 : via DIR(SPDIF/AD)
  //   3
  //   DIR_MUTE
  //   1 : AD                        0 : Other
  //   2
  //   DUMMY_SIG_SEL
  //   1 : DUMMY SIGNAL                         0 :  NORMAL PLAY
  //   1
  //   Reserve
  //   0
  //   BS_MUTE
  //   1 :  NORMAL(PCM Playback)          0 : BS Decode Playback
  //   DSPIN DATA SELECTOR
  //   Histories
  //   Histories
  //   Ver.
  //   Date
  //   Name
  //   Discription
  //   Ver.
  //   Date
  //   Name
  //   Discription
  //   61.01
  //   5-Sep.-'16
  //   H.Niimura
  //   1st issue
  //   DAC_MUTE BLOCK
  //   H_MUTE
  //   DSP OUT & DAC CLK Slecter
  //   DIR/HDIM CLK SELECTOR
  //   MUTE MCK SELECTOR
  //   If using Jitter Clean function, Select PLD register MCKSEL=01, 
  //   DIR AUXILIARY INPUT SELECTOR
  //   PCM9211 register RXSEL=Fh, TXSSRC=4h, TXPSRC=4h, TXSCK=souce MCK ratio, 
  //   TXDSD=1h, TXFMT=0h, MOSSRC=1h, MOPSRC=4h
  //   TO CPU
  //   61.01 Change Connection
  //   To PCM9211 MPIO_B
  //   To PCM9211 MPIO_B
  //   To PCM9211 MPIO_B
  //   DSP BYPASS BLOCK
  //   MUTE CLK SYNC BLOCK
  //   To PCM9211 MPIO_B
  //   ERRMUTE turned on, CLK_MUTE is turned on after 38mS.
  //   not used PIN
  //   MAIN ADC BLOCK
  //   NC (54)
  //   61.01 Add LEGO block
  //   to DSP (1)
  //   from LEGO (2)
  //   24.576MHz
  //   To MAIN ADC
  //   To MAIN ADC
  //   to LEGO (2)
  //   from DSP (1)
  //   To MAIN ADC
  //   50.03 Change OUTPUT -> INPUT
  //   LEGO ADC BLOCK
  //   61.01 Add LEGO block
  //   from DIR (3)
  //   Test Point (8)
  //   24.576MHz
  //   Z2 LEGOBCK
  //   Z2 LEGOLRCK
  //   22.5792MHz
  //   LEGO DSD BLOCK
  //   SeparateADC(X6300_LPP_MP) : R1226(PD) by X63
  //   Z2 LEGODATA
  //   61.01 Add LEGO block
  //   En_TDM_misalignment = 1'b0
  //   Non by X63
  //   LEGODSDL
  //   AIOS4_PWM3 : RR2290(PD) by X43
  //   LEGODSDR
  //   ADC_FS_441 = "L" by X63
  //   GND by X43
  //   Enable_Workaround = "H"
  //   DSD_Protect_EN = NET_GPIO0  by X63
  //   Protect_EN is FullScal Protect enable PIN
  //   X63   NOT:NO
  //   X43   NOT:YES
endmodule
